# EAGLE design Blinky_Board (EAGLE 9.2.2)
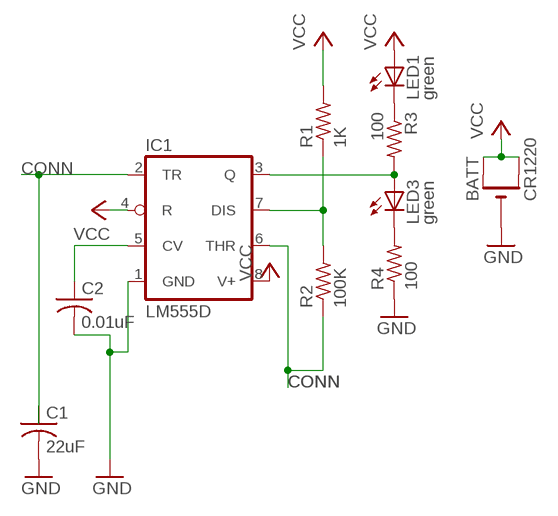
[diagram p0: schematic, sheet 1]

## Parts
BATT  CR1220  CR1220SMT  [CR1220-SMD]
C1  22uF  C-USC0805  [C0805]
C2  0.01uF  C-USC0805  [C0805]
IC1  LM555D  [SO08]
LED1  green  LEDCHIPLED_0805  [CHIPLED_0805]
LED3  green  LEDCHIPLED_0805  [CHIPLED_0805]
R1  1K  R-US_R0805  [R0805]
R2  100K  R-US_R0805  [R0805]
R3  100  R-US_R0805  [R0805]
R4  100  R-US_R0805  [R0805]

## Nets
CONN: C1.1 IC1.2(TR) IC1.6(THR) R2.1
GND: BATT.- C1.2 R4.1
N$1: LED1.C R3.1
N$2: IC1.3(Q) LED3.A R3.2
N$3: LED3.C R4.2
N$4: IC1.7(DIS) R1.1 R2.2
N$6: C2.2 IC1.1(GND) ; supply symbol labelled GND
N$7: C2.1 IC1.5(CV)
VCC: BATT.+$1(+) BATT.+$2(+1) IC1.4(R) IC1.8(V+) LED1.A R1.2

## Library data of the parts
BATT = adafruit:CR1220: CR1216/CR1220/CR1225 12mm 3V lithium coin cell Great for battery packup. Both SMT and THM holders. Note the THM package has the ground pads on both sides of the PCB so that the masks are the same - this reduces the cost
C1 C2 = adafruit:C-US: CAPACITOR, American symbol
IC1 = adafruit:*555: TIMER Changed DIP package to have round (not oval) pin pads http://www.ladyada.net/library/pcb/eaglelibrary.html
LED1 LED3 = adafruit:LED: LED OSRAM: - CHIPLED LG R971, LG N971, LY N971, LG Q971, LY Q971, LO R971, LY R971 LH N974, LH R974 LS Q976, LO Q976, LY Q976 LO Q996 - Hyper CHIPLED LW Q18S LB Q993, LB Q99A, LB R99A - SideLED LS A670, LO A670, LY A670, LG A670, LP A670 LB A673, LV A673, LT A673, LW A673 LH A674 LY A675 LS A676, LA A676, LO A676, LY A676, LW A676 LS A679, LY A679, LG A679 - Hyper Micro SIDELED® LS Y876, LA Y876, LO Y876, LY Y876 LT Y87S - SmartLED LW L88C, LW L88S LB L89C, LB L89S, LG L890 LS L89K, LO L89K, LY L89K LS L896, LA L896, LO L896, LY L896 - TOPLED LS T670, LO T670, LY T670, LG T670, LP T670 LSG T670, LSP T670, LSY T670, LOP T670, LYG T670 LG T671, LOG T671, LSG T671 LB T673, LV T673, LT T673, LW T673 LH T674 LS T676, LA T676, LO T676, LY T676, LB T676, LH T676, LSB T676, LW T676 LB T67C, LV T67C, LT T67C, LS T67K, LO T67K, LY T67K, LW E67C LS E67B, LA E67B, LO E67B, LY E67B, LB E67C, LV E67C, LT E67C LW T67C LS T679, LY T679, LG T679 LS T770, LO T770, LY T770, LG T770, LP T770 LB T773, LV T773, LT T773, LW T773 LH T774 LS E675, LA E675, LY E675, LS T675 LS T776, LA T776, LO T776, LY T776, LB T776 LHGB T686 LT T68C, LB T68C - Hyper Mini TOPLED® LB M676 - Mini TOPLED Santana® LG M470 LS M47K, LO M47K, LY M47K Source: http://www.osram.convergy.de/
R1-R4 = adafruit:R-US_: RESISTOR, American symbol

## Net classes
0 default: width 0.305 mm, drill 0.508 mm, clearance 0.254 mm

## Board
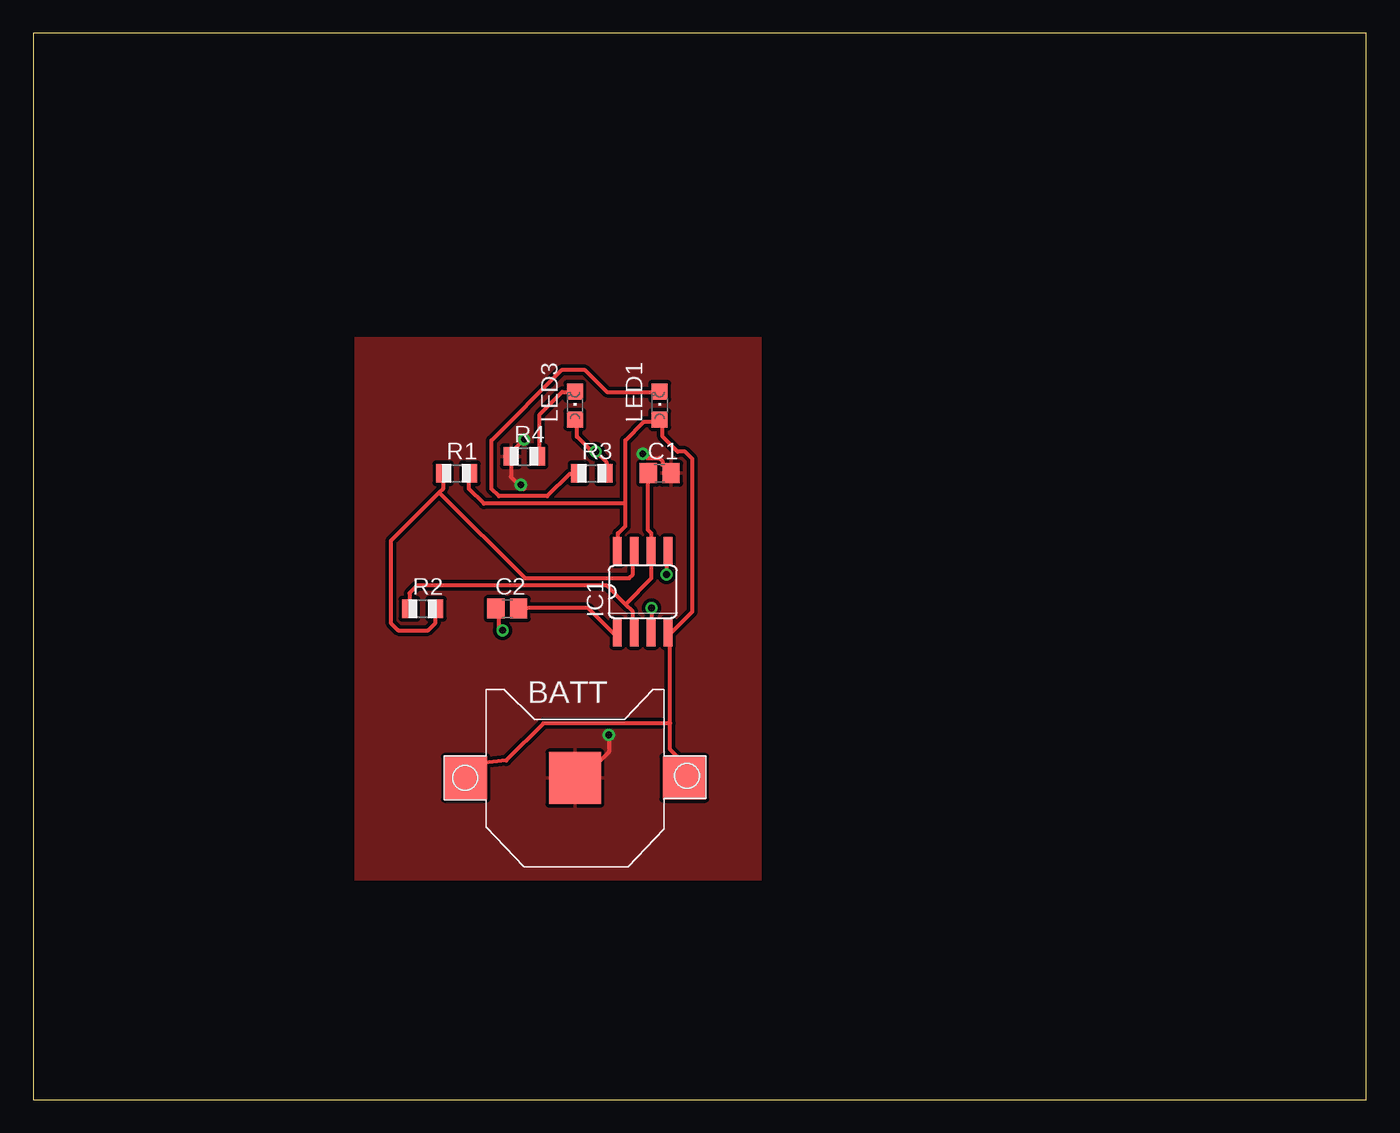
[diagram p1: board, top side]
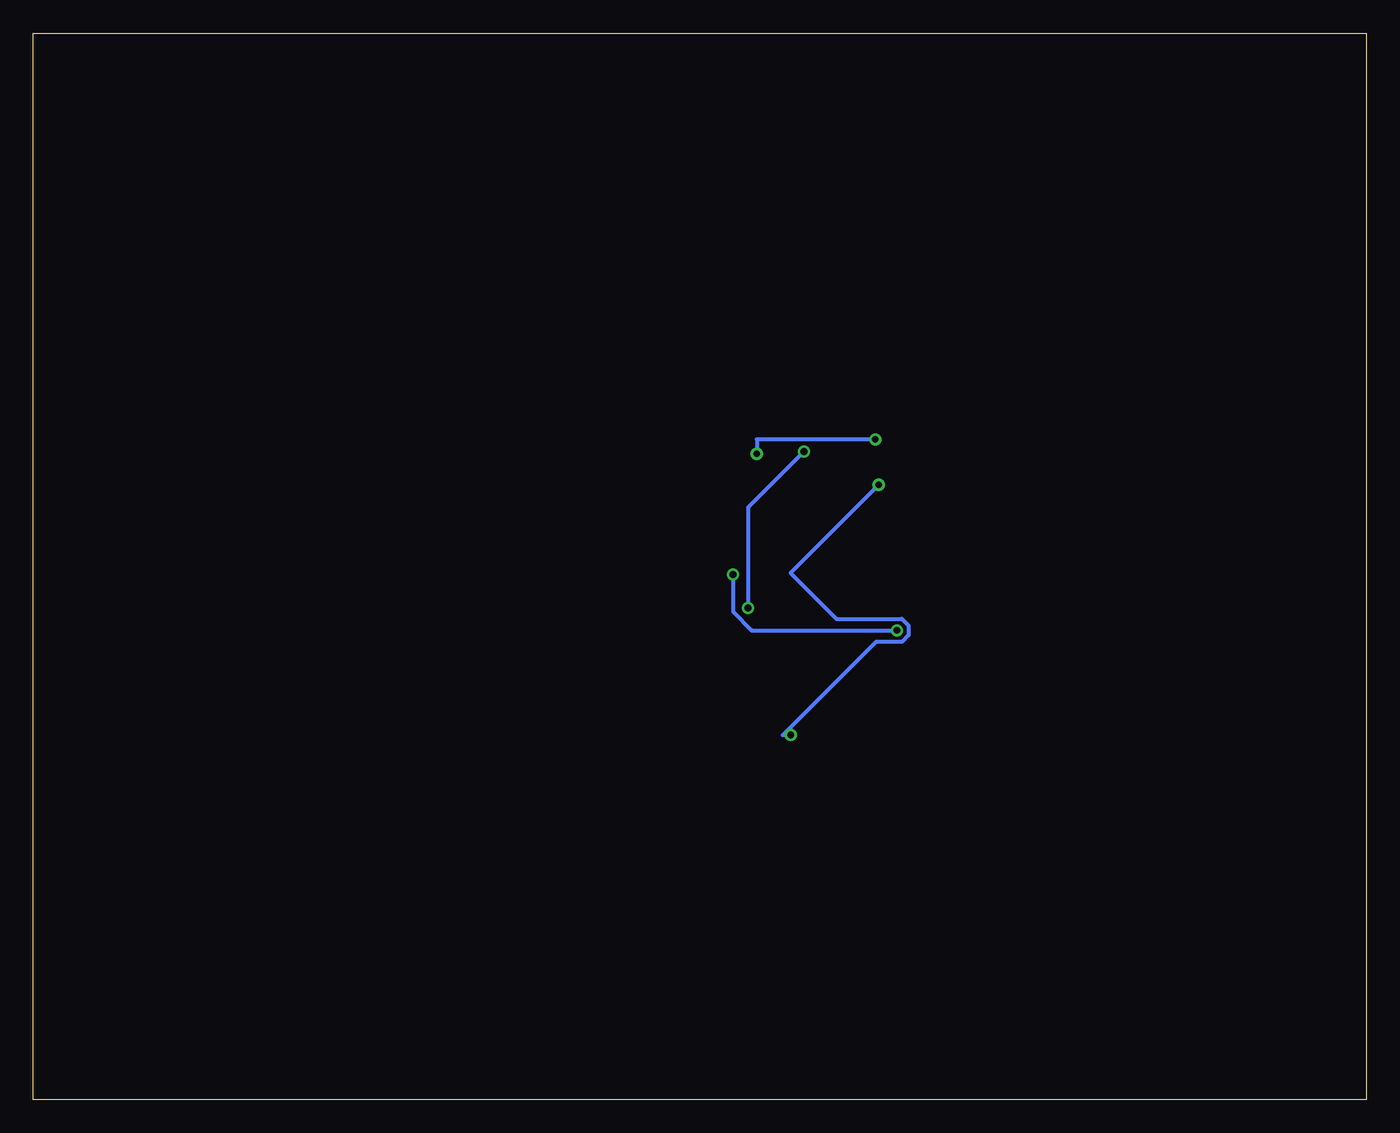
[diagram p2: board, bottom side, seen from below]

Size 100 x 80 mm. Coordinates in mm from the lower left corner, seen from the top.
Outline: 0,0 100,0 100,80 0,80 0,0
Copper layers (1*16): Top 0.035mm / dielectric 1.5mm / Bottom 0.035mm
Design rules "default": minimum track width 6mil, minimum drill 0.35mm, track to track 6mil, track to pad 6mil, pad to pad 6mil, via to via 6mil, smd to smd 6mil, copper to edge 40mil, drill to drill 6mil, minimum pad ring 10mil, minimum via ring 8mil, stop-mask expansion 4mil, vias tented up to drill 0mil, thermal gap 10mil

### Footprints (pad centres in the part's own frame; a part is rotated, then mirrored left to right if it is on the bottom)
CR1220-SMD = smd 3.2 x 3.2: +$1 -8.2,0; +$2 8.2,0 | smd 3.9 x 3.9: - 0,0
C0805 = smd 1.3 x 1.5: 1 -0.85,0; 2 0.85,0
SO08 = smd 0.66 x 2.032: 1 -1.905,-3.073; 2 -0.635,-3.073; 3 0.635,-3.073; 4 1.905,-3.073; 5 1.905,3.073; 6 0.635,3.073; 7 -0.635,3.073; 8 -1.905,3.073
CHIPLED_0805 = smd 1.2 x 1.2: A 0,-1.05; C 0,1.05
R0805 = smd 1.1 x 1.4: 1 -1,0; 2 1,0

### Placement (x,y rotation side)
BATT  40.64,24.13 0 top
C1  46.99,46.99 0 top
C2  35.56,36.83 0 top
IC1  45.72,38.1 0 top
LED1  46.99,52.07 0 top
LED3  40.64,52.07 0 top
R1  31.75,46.99 0 top
R2  29.21,36.83 0 top
R3  41.91,46.99 0 top
R4  36.83,48.26 0 top

### Tracks (layer width: path | path; a pad name or v marks a point on that pad's centre or on a via)
CONN
  Top 0.305: C1.1 46.1,46.94 46.1,42.75 46.38,42.47 46.38,41.35 IC1.6 46.38,41.07 46.38,39.12 44.42,37.16 | 44.42,37.16 44.98,36.6 44.98,35.2 IC1.2 | 44.42,37.16 43.03,38.56 28.78,38.56 28.22,38 28.22,36.88 R2.1
GND  (via drill 0.51)
  Top 0.305: v36.83,49.53 35.83,48.53 R4.1 35.83,46.72 36.73,45.82 36.83,45.82 36.83,45.87 v36.57,46.13 | v45.72,48.45 46.02,48.15 46.96,48.15 47.2,47.91 47.2,47.63 C1.2 | v43.18,27.36 43.18,26.09 41.22,24.13 BATT.-
  Bottom 0.305: v36.83,49.53 45.72,49.53 v45.72,48.45 45.72,48.26 | v36.57,46.13 43.18,39.52 39.73,36.07 34.85,36.07 34.34,35.56 34.34,34.85 34.85,34.34 36.78,34.34 43.76,27.36 v43.18,27.36
  pour Top: 24.13,57.15 24.13,16.51 54.61,16.51 54.61,57.15
N$1
  Top 0.305: LED1.C 46.94,53.09 43.03,53.09 41.35,54.76 39.67,54.76 34.37,49.45 34.37,45.82 34.92,45.26 38.56,45.26 40.23,46.94 40.79,46.94 R3.1
N$2  (via drill 0.51)
  Top 0.305: LED3.A 40.79,50.85 40.79,49.73 41.91,48.62 v42.19,48.62 43.03,47.78 43.03,47.22 R3.2 | v46.38,36.88 46.38,35.2 IC1.3
  Bottom 0.305: v46.38,36.88 46.38,44.42 v42.19,48.62
N$3
  Top 0.305: LED3.C 40.51,53.09 39.67,53.09 38,51.41 38,48.49 R4.2
N$4
  Top 0.305: 30.45,45.54 30.73,45.82 30.73,46.94 R1.1 | 30.45,45.54 26.82,41.91 26.82,35.76 27.38,35.2 29.62,35.2 30.18,35.76 30.18,36.6 R2.2 | 30.45,45.54 36.88,39.12 44.7,39.12 44.98,39.4 44.98,41.07 IC1.7
N$6
  Top 0.305: C2.2 36.6,36.88 41.63,36.88 43.59,34.92 IC1.1
N$7  (via drill 0.51)
  Top 0.305: v35.2,35.2 34.92,35.48 34.92,36.6 C2.1 | v47.5,39.4 47.5,41.07 IC1.5
  Bottom 0.305: v35.2,35.2 46.1,35.2 47.5,36.6 v47.5,39.4
VCC
  Top 0.305: 44.42,44.7 44.42,43.03 43.87,42.47 43.87,41.35 IC1.8 | 44.42,44.7 44.42,49.45 45.82,50.85 46.94,50.85 LED1.A 47.22,50.85 47.22,49.73 48.34,48.62 48.9,48.62 49.45,48.06 49.45,36.6 47.78,34.92 | 44.42,44.7 33.81,44.7 32.69,45.82 32.69,46.94 R1.2 | 47.78,28.22 47.78,26.26 48.7,25.34 BATT.+$2 | 47.78,28.22 47.78,34.92 | 47.78,28.22 38.28,28.22 35.48,25.43 33.54,25.23 BATT.+$1 | 47.78,34.92 IC1.4